# EAGLE design monitor_12 (EAGLE 7.2.0)
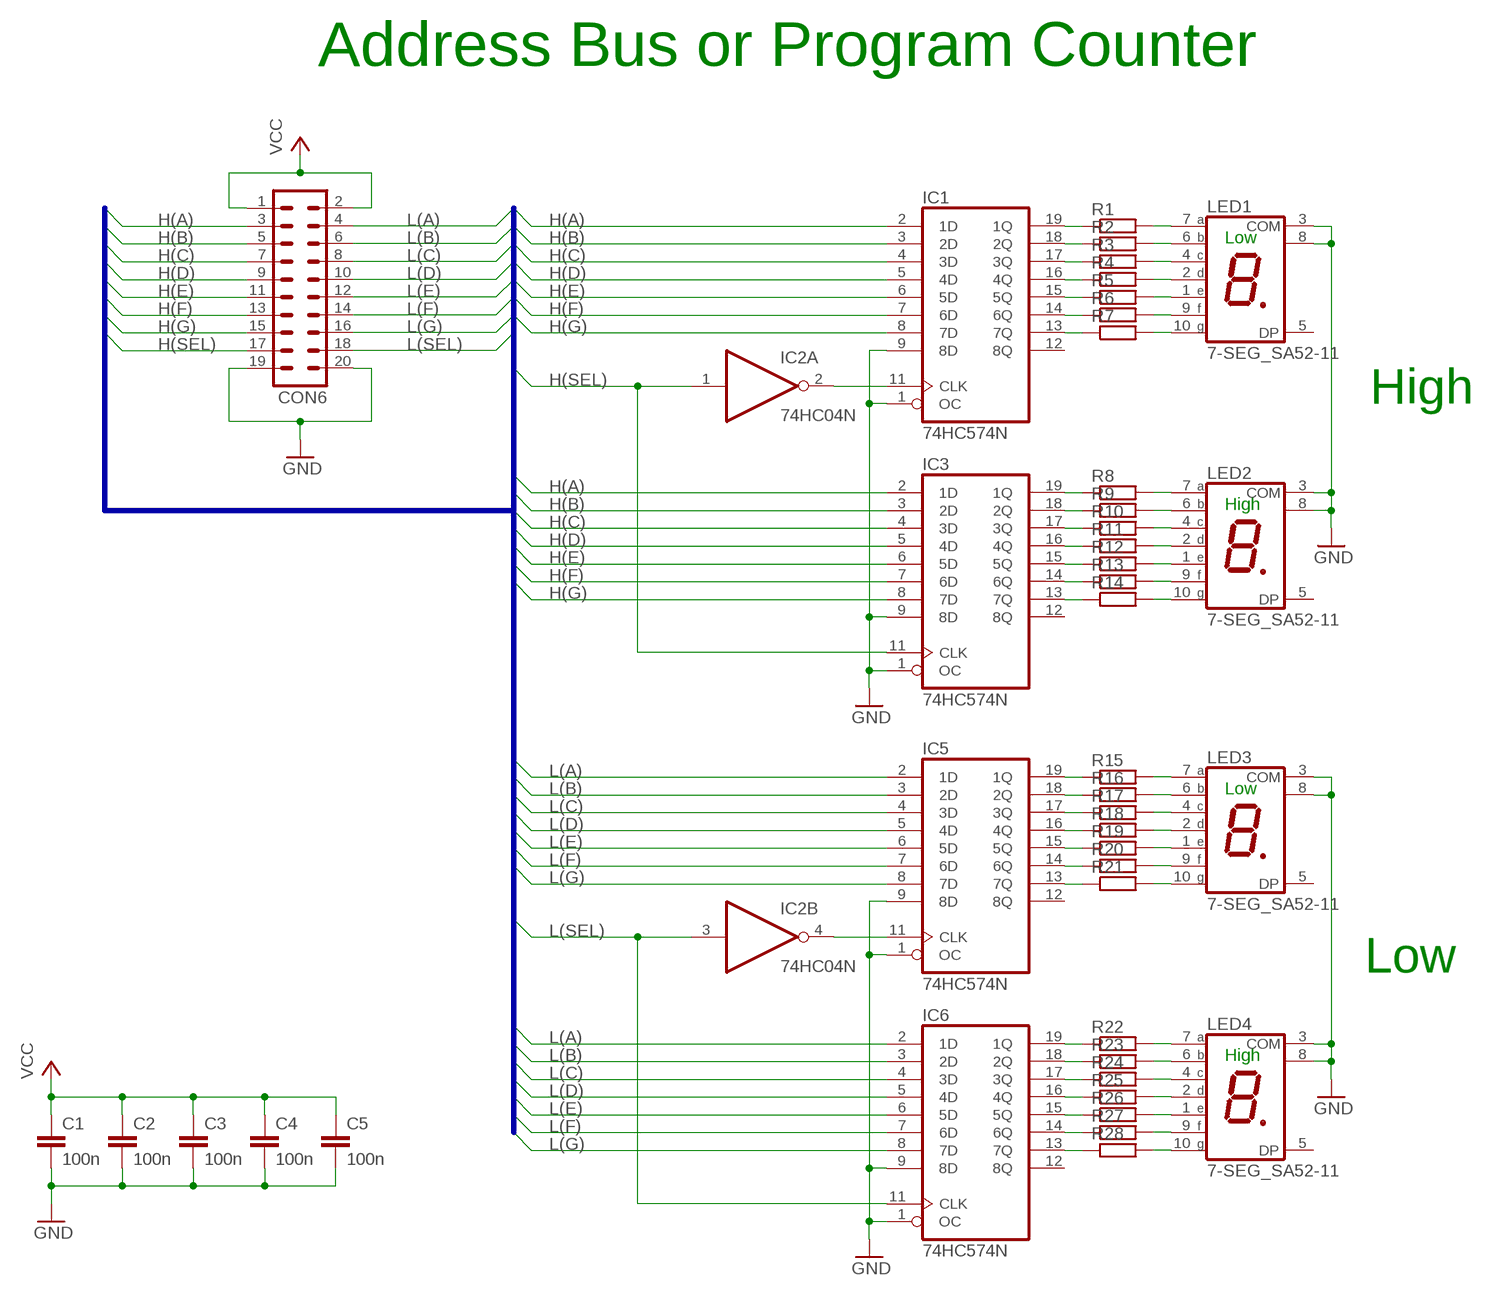
[diagram p0: schematic, sheet 1]

## Parts
C1  100n  C-EU050-024X044  [C050-024X044]
C2  100n  C-EU050-024X044  [C050-024X044]
C3  100n  C-EU050-024X044  [C050-024X044]
C4  100n  C-EU050-024X044  [C050-024X044]
C5  100n  C-EU050-024X044  [C050-024X044]
CON6  ML20L  [ML20L]
IC1  74HC574N  [DIL20]
IC2  74HC04N  [DIL14]
IC3  74HC574N  [DIL20]
IC5  74HC574N  [DIL20]
IC6  74HC574N  [DIL20]
LED1  7-SEG_SA52-11  [SA52-11]
LED2  7-SEG_SA52-11  [SA52-11]
LED3  7-SEG_SA52-11  [SA52-11]
LED4  7-SEG_SA52-11  [SA52-11]
R1  R-EU_0207/7  [0207/7]
R2  R-EU_0207/7  [0207/7]
R3  R-EU_0207/7  [0207/7]
R4  R-EU_0207/7  [0207/7]
R5  R-EU_0207/7  [0207/7]
R6  R-EU_0207/7  [0207/7]
R7  R-EU_0207/7  [0207/7]
R8  R-EU_0207/7  [0207/7]
R9  R-EU_0207/7  [0207/7]
R10  R-EU_0207/7  [0207/7]
R11  R-EU_0207/7  [0207/7]
R12  R-EU_0207/7  [0207/7]
R13  R-EU_0207/7  [0207/7]
R14  R-EU_0207/7  [0207/7]
R15  R-EU_0207/7  [0207/7]
R16  R-EU_0207/7  [0207/7]
R17  R-EU_0207/7  [0207/7]
R18  R-EU_0207/7  [0207/7]
R19  R-EU_0207/7  [0207/7]
R20  R-EU_0207/7  [0207/7]
R21  R-EU_0207/7  [0207/7]
R22  R-EU_0207/7  [0207/7]
R23  R-EU_0207/7  [0207/7]
R24  R-EU_0207/7  [0207/7]
R25  R-EU_0207/7  [0207/7]
R26  R-EU_0207/7  [0207/7]
R27  R-EU_0207/7  [0207/7]
R28  R-EU_0207/7  [0207/7]

## Nets
GND: C1.2 C2.2 C3.2 C4.2 C5.2 CON6.19 CON6.20 IC1.1(OC) IC1.9(8D) IC3.1(OC) IC3.9(8D) IC5.1(OC) IC5.9(8D) IC6.1(OC) IC6.9(8D) LED1.3(COM) LED1.8(COM) LED2.3(COM) LED2.8(COM) LED3.3(COM) LED3.8(COM) LED4.3(COM) LED4.8(COM)
H(A): CON6.3 IC1.2(1D) IC3.2(1D)
H(B): CON6.5 IC1.3(2D) IC3.3(2D)
H(C): CON6.7 IC1.4(3D) IC3.4(3D)
H(D): CON6.9 IC1.5(4D) IC3.5(4D)
H(E): CON6.11 IC1.6(5D) IC3.6(5D)
H(F): CON6.13 IC1.7(6D) IC3.7(6D)
H(G): CON6.15 IC1.8(7D) IC3.8(7D)
H(SEL): CON6.17 IC2.1(A:I) IC3.11(CLK)
L(A): CON6.4 IC5.2(1D) IC6.2(1D)
L(B): CON6.6 IC5.3(2D) IC6.3(2D)
L(C): CON6.8 IC5.4(3D) IC6.4(3D)
L(D): CON6.10 IC5.5(4D) IC6.5(4D)
L(E): CON6.12 IC5.6(5D) IC6.6(5D)
L(F): CON6.14 IC5.7(6D) IC6.7(6D)
L(G): CON6.16 IC5.8(7D) IC6.8(7D)
L(SEL): CON6.18 IC2.3(B:I) IC6.11(CLK)
N$1: IC6.19(1Q) R22.1
N$2: IC2.4(B:O) IC5.11(CLK)
N$3: LED1.6(B) R2.2
N$4: IC1.19(1Q) R1.1
N$5: IC1.18(2Q) R2.1
N$6: IC1.17(3Q) R3.1
N$7: IC1.16(4Q) R4.1
N$8: IC1.15(5Q) R5.1
N$9: IC1.14(6Q) R6.1
N$10: IC1.13(7Q) R7.1
N$11: LED1.7(A) R1.2
N$12: LED1.4(C) R3.2
N$13: LED1.2(D) R4.2
N$14: LED1.1(E) R5.2
N$15: LED1.9(F) R6.2
N$16: LED1.10(G) R7.2
N$17: IC6.18(2Q) R23.1
N$18: LED2.6(B) R9.2
N$19: IC3.19(1Q) R8.1
N$20: IC3.18(2Q) R9.1
N$21: IC3.17(3Q) R10.1
N$22: IC3.16(4Q) R11.1
N$23: IC3.15(5Q) R12.1
N$24: IC3.14(6Q) R13.1
N$25: IC3.13(7Q) R14.1
N$26: LED2.7(A) R8.2
N$27: LED2.4(C) R10.2
N$28: LED2.2(D) R11.2
N$29: LED2.1(E) R12.2
N$30: LED2.9(F) R13.2
N$31: LED2.10(G) R14.2
N$32: IC1.11(CLK) IC2.2(A:O)
N$33: IC6.17(3Q) R24.1
N$35: LED3.6(B) R16.2
N$36: IC5.19(1Q) R15.1
N$37: IC5.18(2Q) R16.1
N$38: IC5.17(3Q) R17.1
N$39: IC5.16(4Q) R18.1
N$40: IC5.15(5Q) R19.1
N$41: IC5.14(6Q) R20.1
N$42: IC5.13(7Q) R21.1
N$43: LED3.7(A) R15.2
N$44: LED3.4(C) R17.2
N$45: LED3.2(D) R18.2
N$46: LED3.1(E) R19.2
N$47: LED3.9(F) R20.2
N$48: LED3.10(G) R21.2
N$154: LED4.6(B) R23.2
N$158: IC6.16(4Q) R25.1
N$159: IC6.15(5Q) R26.1
N$160: IC6.14(6Q) R27.1
N$161: IC6.13(7Q) R28.1
N$162: LED4.7(A) R22.2
N$163: LED4.4(C) R24.2
N$164: LED4.2(D) R25.2
N$165: LED4.1(E) R26.2
N$166: LED4.9(F) R27.2
N$167: LED4.10(G) R28.2
VCC: C1.1 C2.1 C3.1 C4.1 C5.1 CON6.1 CON6.2
Unconnected: IC1.12(8Q) IC2.5(C:I) IC2.6(C:O) IC2.8(D:O) IC2.9(D:I) IC2.10(E:O) IC2.11(E:I) IC2.12(F:O) IC2.13(F:I) IC3.12(8Q) IC5.12(8Q) IC6.12(8Q) LED1.5(DP) LED2.5(DP) LED3.5(DP) LED4.5(DP)

## Buses
H(A),H(B),H(C),H(D),H(E),H(F),H(G),H(SEL),L(A),L(B),L(C),L(D),L(E),L(F),L(G),L(SEL)

## Notes on the sheet
- Address Bus or Program Counter
- Low
- High
- High
- Low
- Low
- High

## Power pins joined to a net without a drawn wire
GND: IC1.10(GND) IC2.7(P:GND) IC3.10(GND) IC5.10(GND) IC6.10(GND)
VCC: IC1.20(VCC) IC2.14(P:VCC) IC3.20(VCC) IC5.20(VCC) IC6.20(VCC)

## Library data of the parts
C1-C5 = rcl:C-EU: CAPACITOR, European symbol
CON6 = con-ml:ML20L: HARTING; OC_FARNELL: unknown; OC_NEWARK: unknown
IC1 IC3 IC5 IC6 = 74xx-eu:74*574: 8-bit D type FLIP FLOP bus driver
IC2 = 74xx-eu:74*04: Hex INVERTER
LED1-LED4 = display-kingbright:7-SEG_: Kingbright 14.2mm (0.56 INCH) SINGLE DIGIT NUMERIC DUISPLAY Source: SA56-11EWA(Ver1189471036.pdf; OC_FARNELL: unknown; OC_NEWARK: unknown
R1-R28 = resistor:R-EU_: RESISTOR, European symbol

## Board
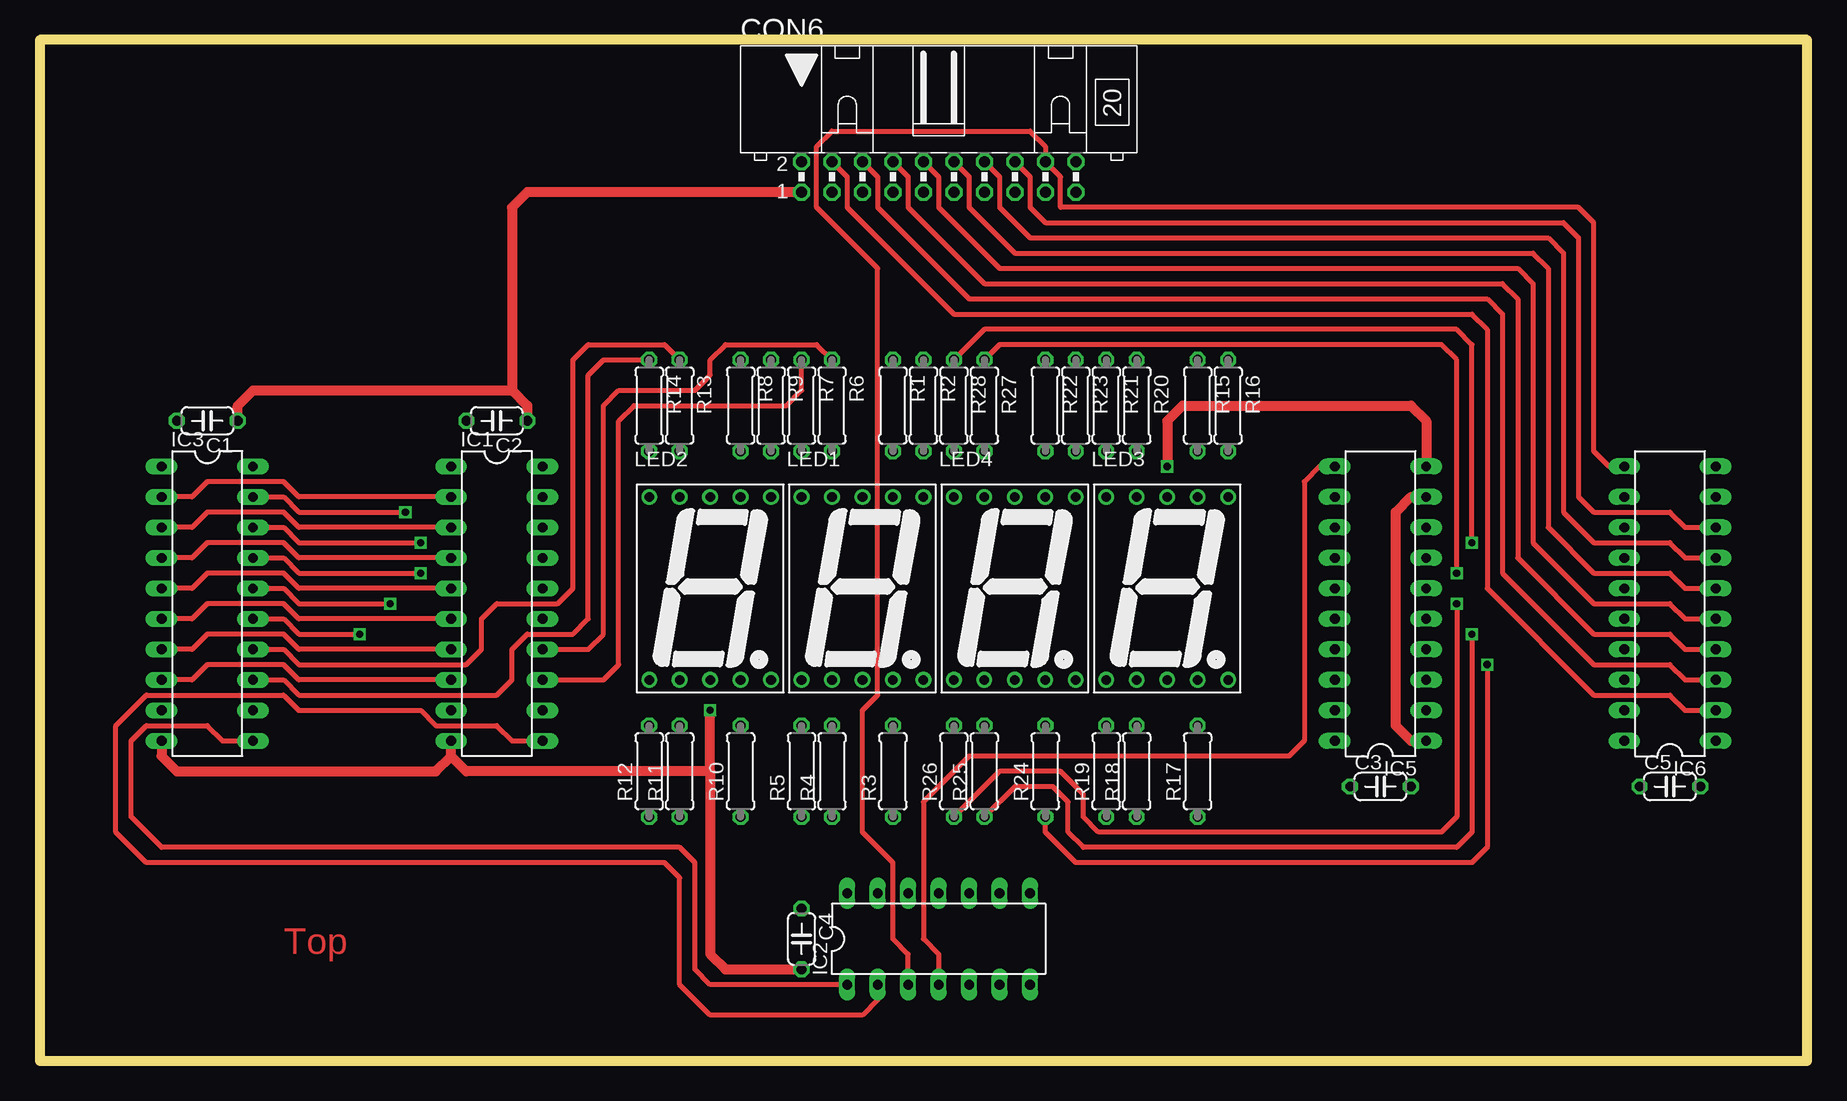
[diagram p1: board, top side]
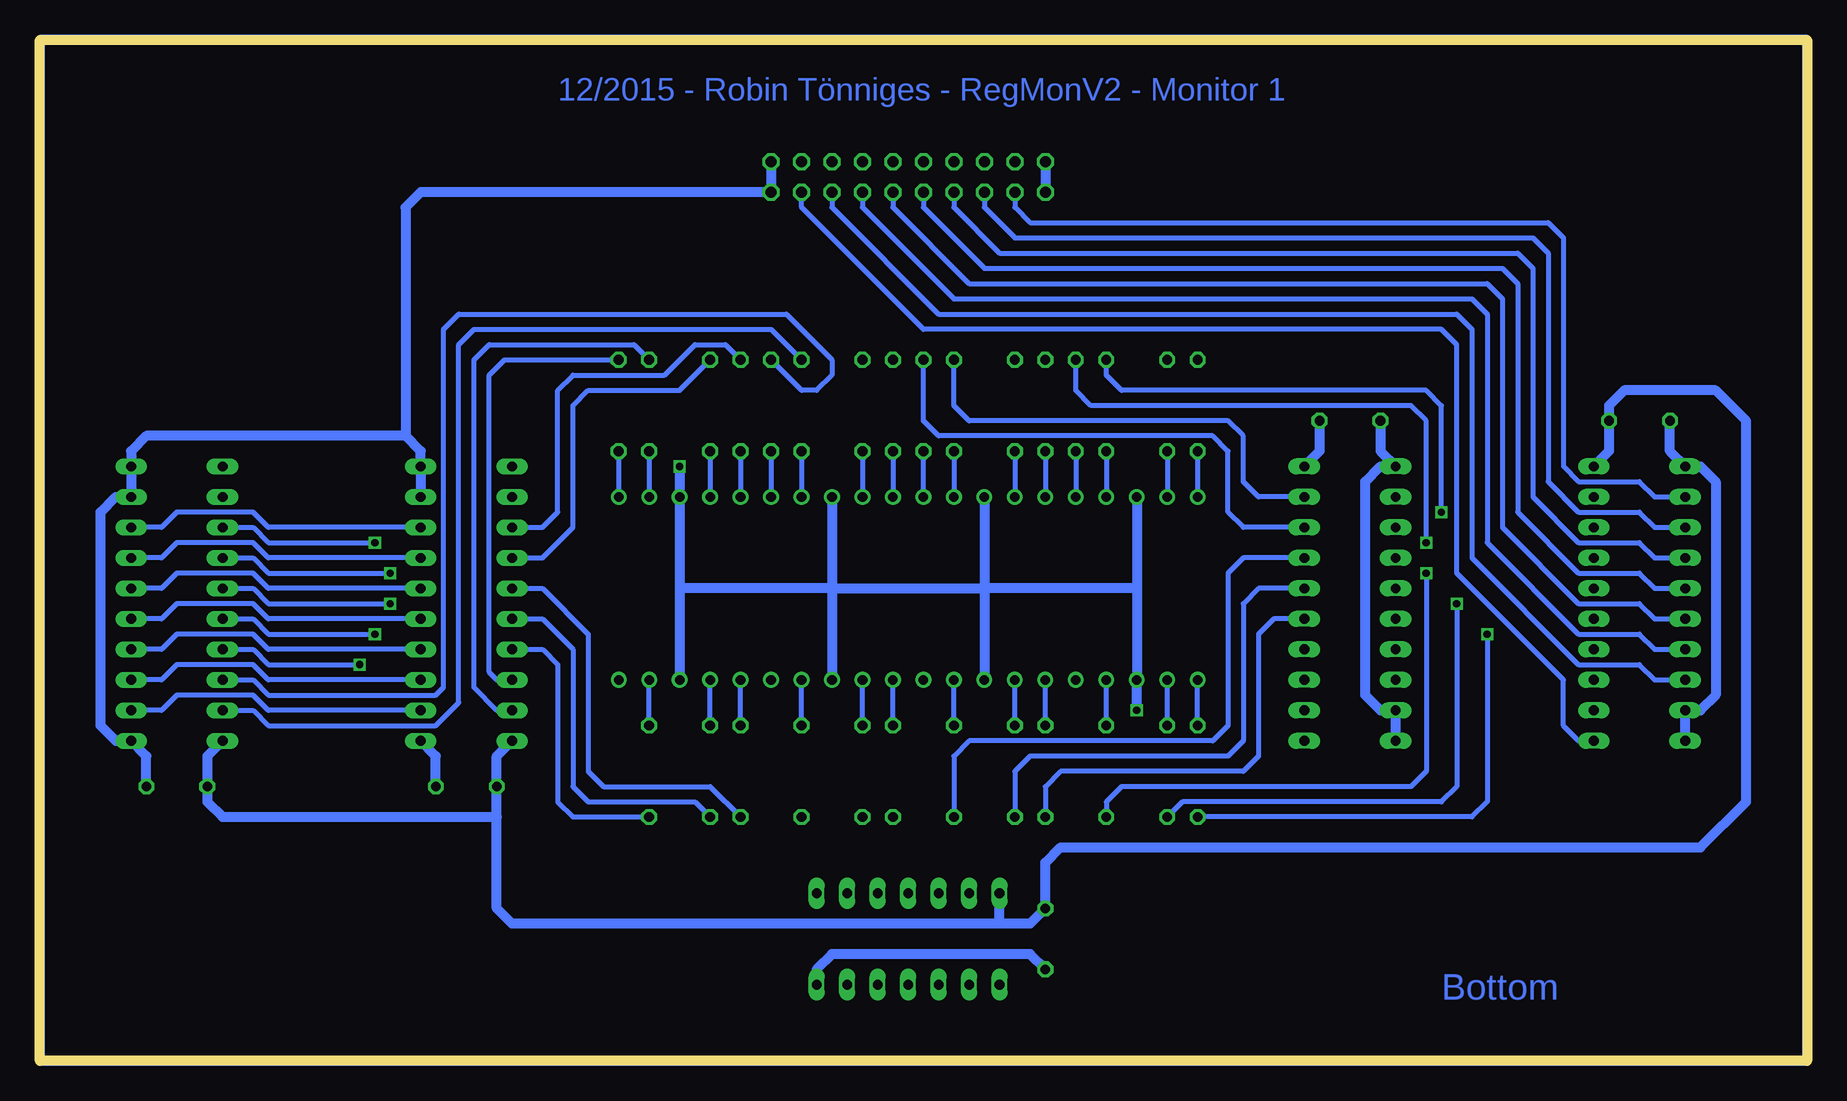
[diagram p2: board, bottom side, seen from below]

Size 147.32 x 85.09 mm. Coordinates in mm from the lower left corner, seen from the top.
Outline: 0,0 147.32,0 147.32,85.09 0,85.09 0,0
Copper layers (1*16): Top 0.035mm / dielectric 1.5mm / Bottom 0.035mm
Design rules "default": minimum track width 10mil, minimum drill 24mil, track to track 8mil, track to pad 8mil, pad to pad 8mil, via to via 8mil, smd to smd 8mil, copper to edge 40mil, drill to drill 8mil, minimum pad ring 10mil, minimum via ring 8mil, stop-mask expansion 4mil, vias tented up to drill 0mil, thermal gap 10mil

### Footprints (pad centres in the part's own frame; a part is rotated, then mirrored left to right if it is on the bottom)
C050-024X044 = drill 0.813 octagon: 1 -2.54,0; 2 2.54,0
ML20L = drill 0.914 octagon: 1 -11.43,-1.27; 2 -11.43,1.27; 3 -8.89,-1.27; 4 -8.89,1.27; 5 -6.35,-1.27; 6 -6.35,1.27; 7 -3.81,-1.27; 8 -3.81,1.27; 9 -1.27,-1.27; 10 -1.27,1.27; 11 1.27,-1.27; 12 1.27,1.27; 13 3.81,-1.27; 14 3.81,1.27; 15 6.35,-1.27; 16 6.35,1.27; 17 8.89,-1.27; 18 8.89,1.27; 19 11.43,-1.27; 20 11.43,1.27
DIL20 = drill 0.813 long: 1 -11.43,-3.81; 2 -8.89,-3.81; 3 -6.35,-3.81; 4 -3.81,-3.81; 5 -1.27,-3.81; 6 1.27,-3.81; 7 3.81,-3.81; 8 6.35,-3.81; 9 8.89,-3.81; 10 11.43,-3.81; 11 11.43,3.81; 12 8.89,3.81; 13 6.35,3.81; 14 3.81,3.81; 15 1.27,3.81; 16 -1.27,3.81; 17 -3.81,3.81; 18 -6.35,3.81; 19 -8.89,3.81; 20 -11.43,3.81
DIL14 = drill 0.813 long: 1 -7.62,-3.81; 2 -5.08,-3.81; 3 -2.54,-3.81; 4 0,-3.81; 5 2.54,-3.81; 6 5.08,-3.81; 7 7.62,-3.81; 8 7.62,3.81; 9 5.08,3.81; 10 2.54,3.81; 11 0,3.81; 12 -2.54,3.81; 13 -5.08,3.81; 14 -7.62,3.81
SA52-11 = drill 0.8: 1 -5.08,-7.62; 2 -2.54,-7.62; 3 0,-7.62; 4 2.54,-7.62; 5 5.08,-7.62; 6 5.08,7.62; 7 2.54,7.62; 8 0,7.62; 9 -2.54,7.62; 10 -5.08,7.62
0207/7 = drill 0.813 octagon: 1 -3.81,0; 2 3.81,0

### Placement (x,y rotation side)
C1  13.97,53.34 180 top
C2  38.1,53.34 180 top
C3  111.76,22.86 0 top
C4  63.5,10.16 270 top
C5  135.89,22.86 0 top
CON6  74.93,73.66 0 top
IC1  38.1,38.1 270 top
IC2  74.93,10.16 0 top
IC3  13.97,38.1 270 top
IC5  111.76,38.1 90 top
IC6  135.89,38.1 90 top
LED1  68.58,39.37 0 top
LED2  55.88,39.37 0 top
LED3  93.98,39.37 0 top
LED4  81.28,39.37 0 top
R1  71.12,54.61 270 top
R2  73.66,54.61 270 top
R3  71.12,24.13 90 top
R4  66.04,24.13 90 top
R5  63.5,24.13 90 top
R6  66.04,54.61 270 top
R7  63.5,54.61 270 top
R8  58.42,54.61 270 top
R9  60.96,54.61 270 top
R10  58.42,24.13 90 top
R11  53.34,24.13 90 top
R12  50.8,24.13 90 top
R13  53.34,54.61 270 top
R14  50.8,54.61 270 top
R15  96.52,54.61 270 top
R16  99.06,54.61 270 top
R17  96.52,24.13 90 top
R18  91.44,24.13 90 top
R19  88.9,24.13 90 top
R20  91.44,54.61 270 top
R21  88.9,54.61 270 top
R22  83.82,54.61 270 top
R23  86.36,54.61 270 top
R24  83.82,24.13 90 top
R25  78.74,24.13 90 top
R26  76.2,24.13 90 top
R27  78.74,54.61 270 top
R28  76.2,54.61 270 top

### Tracks (layer width: path | path; a pad name or v marks a point on that pad's centre or on a via)
GND  (via drill 0.6)
  Top 0.813: IC5.1 114.3,26.67 113.03,27.94 113.03,45.72 114.3,46.99 IC5.9 | IC3.10 10.16,25.4 11.43,24.13 33.02,24.13 34.29,25.4 | IC5.10 115.57,53.34 114.3,54.61 95.25,54.61 93.98,53.34 v93.98,49.53 | 55.88,24.13 35.56,24.13 34.29,25.4 | 34.29,25.4 IC1.10 | 55.88,24.13 v55.88,29.21 | 55.88,24.13 55.88,8.89 57.15,7.62 C4.2
  Bottom 0.813: IC3.10 IC3.9 8.89,29.21 7.62,30.48 7.62,48.26 8.89,49.53 IC3.1 11.43,50.8 C1.2 | C2.2 35.56,50.8 IC1.1 35.56,49.53 36.83,48.26 36.83,30.48 35.56,29.21 IC1.9 IC1.10 | IC5.9 IC5.10 115.57,50.8 116.84,52.07 | C3.2 114.3,25.4 IC5.1 | C5.2 138.43,25.4 IC6.1 140.97,26.67 142.24,27.94 142.24,45.72 140.97,46.99 IC6.9 IC6.10 139.7,50.8 138.43,52.07 116.84,52.07 | CON6.20 CON6.19 115.57,72.39 116.84,71.12 116.84,52.07 | 55.88,39.37 LED2.3 v55.88,29.21 | LED1.8 68.58,39.37 | 68.58,39.37 LED1.3 | 81.28,39.37 LED4.3 | 93.98,39.37 LED3.8 v93.98,49.53 | 93.98,39.37 LED3.3 | LED2.8 55.88,39.37 | 55.88,39.37 68.58,39.37 | 81.28,39.37 68.58,39.37 | LED4.8 81.28,39.37 | 81.28,39.37 93.98,39.37 | C4.2 64.77,8.89 81.28,8.89 82.55,7.62 IC2.7
H(A)
  Top 0.406: IC1.2 21.59,46.99 20.32,48.26 13.97,48.26 12.7,46.99 IC3.2
  Bottom 0.406: CON6.3 66.04,71.12 64.77,69.85 21.59,69.85 20.32,68.58 20.32,49.53 19.05,48.26 13.97,48.26 12.7,46.99 IC3.2
H(B)
  Top 0.406: IC1.3 21.59,44.45 20.32,45.72 13.97,45.72 12.7,44.45 IC3.3
  Bottom 0.406: CON6.5 68.58,71.12 66.04,68.58 22.86,68.58 21.59,67.31 21.59,48.26 19.05,45.72 13.97,45.72 12.7,44.45 IC3.3
H(C)
  Top 0.406: IC1.4 21.59,41.91 20.32,43.18 13.97,43.18 12.7,41.91 IC3.4
  Bottom 0.406: CON6.7 71.12,71.12 67.31,67.31 24.13,67.31 22.86,66.04 22.86,46.99 19.05,43.18 13.97,43.18 12.7,41.91 IC3.4
H(D)
  Top 0.406: IC1.5 21.59,39.37 20.32,40.64 13.97,40.64 12.7,39.37 IC3.5
  Bottom 0.406: CON6.9 73.66,71.12 68.58,66.04 25.4,66.04 24.13,64.77 24.13,45.72 19.05,40.64 13.97,40.64 12.7,39.37 IC3.5
H(E)
  Top 0.406: IC1.6 21.59,36.83 20.32,38.1 13.97,38.1 12.7,36.83 IC3.6
  Bottom 0.406: CON6.11 76.2,71.12 69.85,64.77 26.67,64.77 25.4,63.5 25.4,44.45 19.05,38.1 13.97,38.1 12.7,36.83 IC3.6
H(F)
  Top 0.406: IC1.7 21.59,34.29 20.32,35.56 13.97,35.56 12.7,34.29 IC3.7
  Bottom 0.406: CON6.13 78.74,71.12 71.12,63.5 27.94,63.5 26.67,62.23 26.67,43.18 19.05,35.56 13.97,35.56 12.7,34.29 IC3.7
H(G)
  Top 0.406: IC1.8 21.59,31.75 20.32,33.02 13.97,33.02 12.7,31.75 IC3.8
  Bottom 0.406: CON6.15 81.28,71.12 72.39,62.23 29.21,62.23 27.94,60.96 27.94,41.91 19.05,33.02 13.97,33.02 12.7,31.75 IC3.8
H(SEL)
  Top 0.406: IC2.1 55.88,6.35 54.61,7.62 54.61,16.51 53.34,17.78 10.16,17.78 7.62,20.32 7.62,26.67 8.89,27.94 13.97,27.94 15.24,26.67 IC3.11
  Bottom 0.406: IC3.11 19.05,26.67 20.32,27.94 20.32,31.75 29.21,40.64 29.21,59.69 30.48,60.96 73.66,60.96 83.82,71.12 CON6.17
L(A)
  Top 0.406: CON6.4 67.31,73.66 67.31,71.12 76.2,62.23 119.38,62.23 120.65,60.96 120.65,39.37 129.54,30.48 135.89,30.48 137.16,29.21 IC6.2
  Bottom 0.406: IC5.2 128.27,29.21 129.54,30.48 135.89,30.48 137.16,29.21 IC6.2
L(B)
  Top 0.406: CON6.6 69.85,73.66 69.85,71.12 77.47,63.5 120.65,63.5 121.92,62.23 121.92,40.64 129.54,33.02 135.89,33.02 137.16,31.75 IC6.3
  Bottom 0.406: IC5.3 128.27,31.75 129.54,33.02 135.89,33.02 137.16,31.75 IC6.3
L(C)
  Top 0.406: CON6.8 72.39,73.66 72.39,71.12 78.74,64.77 121.92,64.77 123.19,63.5 123.19,41.91 129.54,35.56 135.89,35.56 137.16,34.29 IC6.4
  Bottom 0.406: IC5.4 128.27,34.29 129.54,35.56 135.89,35.56 137.16,34.29 IC6.4
L(D)
  Top 0.406: CON6.10 74.93,73.66 74.93,71.12 80.01,66.04 123.19,66.04 124.46,64.77 124.46,43.18 129.54,38.1 135.89,38.1 137.16,36.83 IC6.5
  Bottom 0.406: IC5.5 128.27,36.83 129.54,38.1 135.89,38.1 137.16,36.83 IC6.5
L(E)
  Top 0.406: CON6.12 77.47,73.66 77.47,71.12 81.28,67.31 124.46,67.31 125.73,66.04 125.73,44.45 129.54,40.64 135.89,40.64 137.16,39.37 IC6.6
  Bottom 0.406: IC5.6 128.27,39.37 129.54,40.64 135.89,40.64 137.16,39.37 IC6.6
L(F)
  Top 0.406: CON6.14 80.01,73.66 80.01,71.12 82.55,68.58 125.73,68.58 127,67.31 127,45.72 129.54,43.18 135.89,43.18 137.16,41.91 IC6.7
  Bottom 0.406: IC5.7 128.27,41.91 129.54,43.18 135.89,43.18 137.16,41.91 IC6.7
L(G)
  Top 0.406: CON6.16 82.55,73.66 82.55,71.12 83.82,69.85 127,69.85 128.27,68.58 128.27,46.99 129.54,45.72 135.89,45.72 137.16,44.45 IC6.8
  Bottom 0.406: IC5.8 128.27,44.45 129.54,45.72 135.89,45.72 137.16,44.45 IC6.8
L(SEL)
  Top 0.406: IC6.11 130.81,49.53 129.54,50.8 129.54,69.85 128.27,71.12 85.09,71.12 85.09,73.66 CON6.18 83.82,76.2 82.55,77.47 66.04,77.47 64.77,76.2 64.77,71.12 69.85,66.04 69.85,30.48 68.58,29.21 68.58,19.05 71.12,16.51 71.12,10.16 72.39,8.89 IC2.3
N$1
  Bottom 0.406: IC6.19 129.54,29.21 128.27,27.94 114.3,27.94 112.39,29.84 112.39,59.69 111.12,60.96 86.36,60.96 R22.1
N$2
  Top 0.406: IC5.11 106.68,49.53 105.41,48.26 105.41,26.67 104.14,25.4 77.47,25.4 73.66,21.59 73.66,10.16 74.93,8.89 IC2.4
N$3
  Bottom 0.406: LED1.6 R2.2
N$4
  Bottom 0.406: IC1.19 45.72,46.99 46.99,48.26 46.99,52.07 48.26,53.34 69.85,53.34 71.12,54.61 R1.1
N$5
  Bottom 0.406: IC1.18 46.99,44.45 48.26,45.72 48.26,50.8 49.53,52.07 72.39,52.07 73.66,53.34 R2.1
N$6
  Bottom 0.406: IC1.17 46.99,41.91 48.26,40.64 48.26,27.94 49.53,26.67 69.85,26.67 71.12,25.4 R3.1
N$7
  Bottom 0.406: IC1.16 45.72,39.37 46.99,38.1 46.99,26.67 48.26,25.4 64.77,25.4 66.04,24.13 R4.1
N$8
  Bottom 0.406: IC1.15 44.45,36.83 45.72,35.56 45.72,25.4 46.99,24.13 62.23,24.13 63.5,22.86 R5.1
N$9
  Top 0.406: IC1.14 45.72,34.29 46.99,35.56 46.99,54.61 48.26,55.88 54.61,55.88 55.88,57.15 55.88,58.42 57.15,59.69 64.77,59.69 R6.1
N$10
  Top 0.406: IC1.13 46.99,31.75 48.26,33.02 48.26,53.34 49.53,54.61 62.23,54.61 63.5,55.88 R7.1
N$11
  Bottom 0.406: R1.2 LED1.7
N$12
  Bottom 0.406: R3.2 LED1.4
N$13
  Bottom 0.406: R4.2 LED1.2
N$14
  Bottom 0.406: R5.2 LED1.1
N$15
  Bottom 0.406: R6.2 LED1.9
N$16
  Bottom 0.406: R7.2 LED1.10
N$17
  Bottom 0.406: IC6.18 129.54,31.75 128.27,30.48 114.3,30.48 113.67,31.11 113.67,60.96 112.39,62.23 85.09,62.23 81.28,58.42 81.28,57.15 82.55,55.88 83.82,55.88 R23.1
N$18
  Bottom 0.406: R9.2 LED2.6
N$19  (via drill 0.6)
  Top 0.406: IC3.19 20.32,46.99 21.59,45.72 v30.48,45.72
  Bottom 0.406: v30.48,45.72 30.48,54.61 31.75,55.88 57.15,55.88 58.42,57.15 R8.1
N$20  (via drill 0.6)
  Top 0.406: IC3.18 20.32,44.45 21.59,43.18 v31.75,43.18
  Bottom 0.406: v31.75,43.18 31.75,53.34 33.02,54.61 59.69,54.61 60.96,55.88 R9.1
N$21  (via drill 0.6)
  Top 0.406: IC3.17 20.32,41.91 21.59,40.64 v31.75,40.64
  Bottom 0.406: v31.75,40.64 31.75,24.13 33.02,22.86 57.15,22.86 58.42,21.59 R10.1
N$22  (via drill 0.6)
  Top 0.406: IC3.16 20.32,39.37 21.59,38.1 v29.21,38.1
  Bottom 0.406: v29.21,38.1 29.21,22.86 30.48,21.59 52.07,21.59 R11.1
N$23  (via drill 0.6)
  Top 0.406: IC3.15 20.32,36.83 21.59,35.56 v26.67,35.56
  Bottom 0.406: v26.67,35.56 26.67,21.59 27.94,20.32 R12.1
N$24
  Top 0.406: IC3.14 20.32,34.29 21.59,33.02 35.56,33.02 36.83,34.29 36.83,36.83 38.1,38.1 43.18,38.1 44.45,39.37 44.45,58.42 45.72,59.69 52.07,59.69 R13.1
N$25
  Top 0.406: IC3.13 20.32,31.75 21.59,30.48 38.1,30.48 39.37,31.75 39.37,34.29 40.64,35.56 44.45,35.56 45.72,36.83 45.72,57.15 46.99,58.42 R14.1
N$26
  Bottom 0.406: R8.2 LED2.7
N$27
  Bottom 0.406: R10.2 LED2.4
N$28
  Bottom 0.406: R11.2 LED2.2
N$29
  Bottom 0.406: R12.2 LED2.1
N$30
  Bottom 0.406: R13.2 LED2.9
N$31
  Bottom 0.406: R14.2 LED2.10
N$32
  Top 0.406: IC2.2 69.85,5.08 68.58,3.81 55.88,3.81 53.34,6.35 53.34,15.24 52.07,16.51 8.89,16.51 6.35,19.05 6.35,27.94 8.89,30.48 20.32,30.48 21.59,29.21 31.75,29.21 33.02,27.94 38.1,27.94 39.37,26.67 IC1.11
N$33  (via drill 0.6)
  Top 0.406: v120.65,33.02 120.65,17.78 119.38,16.51 86.36,16.51 83.82,19.05 R24.1
  Bottom 0.406: IC6.17 129.54,34.29 128.27,33.02 v120.65,33.02
N$34
  Bottom 0.813: 0,0 0,85.09 147.32,85.09 147.32,0 0,0
N$35
  Bottom 0.406: R16.2 LED3.6
N$36
  Bottom 0.406: IC5.19 109.22,29.21 111.12,31.11 111.12,58.42 109.86,59.69 97.79,59.69 R15.1
N$37
  Bottom 0.406: IC5.18 109.22,31.75 109.86,32.38 109.86,57.15 108.58,58.42 R16.1
N$38
  Bottom 0.406: IC5.17 105.41,34.29 104.14,33.02 104.14,21.59 102.87,20.32 R17.1
N$39
  Bottom 0.406: IC5.16 105.41,36.83 102.87,34.29 102.87,22.86 101.6,21.59 92.71,21.59 R18.1
N$40
  Bottom 0.406: IC5.15 105.41,39.37 101.6,35.56 101.6,24.13 100.33,22.86 91.44,22.86 R19.1
N$41
  Bottom 0.406: IC5.14 105.41,41.91 102.87,44.45 102.87,54.61 101.6,55.88 93.98,55.88 R20.1
N$42
  Bottom 0.406: IC5.13 105.41,44.45 104.14,45.72 104.14,55.88 102.87,57.15 95.25,57.15 92.71,59.69 90.17,59.69 R21.1
N$43
  Bottom 0.406: R15.2 LED3.7
N$44
  Bottom 0.406: R17.2 LED3.4
N$45
  Bottom 0.406: R18.2 LED3.2
N$46
  Bottom 0.406: R19.2 LED3.1
N$47
  Bottom 0.406: R20.2 LED3.9
N$48
  Bottom 0.406: R21.2 LED3.10
N$154
  Bottom 0.406: R23.2 LED4.6
N$158  (via drill 0.6)
  Top 0.406: v119.38,35.56 119.38,19.05 118.11,17.78 87,17.78 85.72,19.05 85.72,21.59 84.45,22.86 81.28,22.86 R25.1
  Bottom 0.406: IC6.16 129.54,36.83 128.27,35.56 v119.38,35.56
N$159  (via drill 0.6)
  Top 0.406: v118.11,38.1 118.11,20.32 116.84,19.05 88.27,19.05 87,20.32 87,22.23 85.09,24.13 80.01,24.13 R26.1
  Bottom 0.406: IC6.15 129.54,39.37 128.27,38.1 v118.11,38.1
N$160  (via drill 0.6)
  Top 0.406: v118.11,40.64 118.11,58.42 116.84,59.69 80.01,59.69 R27.1
  Bottom 0.406: IC6.14 129.54,41.91 128.27,40.64 v118.11,40.64
N$161  (via drill 0.6)
  Top 0.406: v119.38,43.18 119.38,59.69 118.11,60.96 78.74,60.96 R28.1
  Bottom 0.406: IC6.13 129.54,44.45 128.27,43.18 v119.38,43.18
N$162
  Bottom 0.406: R22.2 LED4.7
N$163
  Bottom 0.406: R24.2 LED4.4
N$164
  Bottom 0.406: R25.2 LED4.2
N$165
  Bottom 0.406: R26.2 LED4.1
N$166
  Bottom 0.406: R27.2 LED4.9
N$167
  Bottom 0.406: R28.2 LED4.10
VCC
  Top 0.813: C1.1 16.51,54.61 17.78,55.88 39.37,55.88 | 39.37,55.88 40.64,54.61 C2.1 | CON6.1 40.64,72.39 39.37,71.12 39.37,55.88
  Bottom 0.813: IC3.20 16.51,50.8 C1.1 16.51,54.61 15.24,55.88 7.62,55.88 5.08,53.34 5.08,21.59 8.89,17.78 62.23,17.78 63.5,16.51 C4.1 64.77,11.43 67.31,11.43 | C2.1 40.64,50.8 IC1.20 | IC5.20 109.22,25.4 C3.1 109.22,20.32 | CON6.2 CON6.1 | IC6.20 133.35,25.4 C5.1 133.35,21.59 132.08,20.32 109.22,20.32 | 67.31,11.43 IC2.14 | 67.31,11.43 107.95,11.43 109.22,12.7 109.22,20.32

### Text on the board
Top: Top
Bottom: 12/2015 - Robin Tönniges - RegMonV2 - Monitor 1 | Bottom